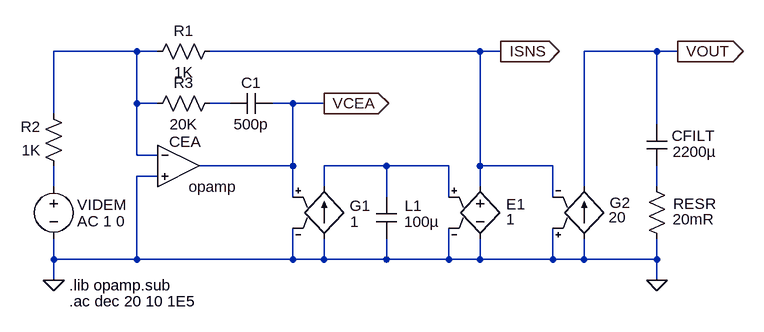
[diagram p0: schematic outfiltimodeb.asc]
outfiltimodeb.asc, the LTspice schematic file:
Version 4
SHEET 1 880 680
WIRE -944 224 -944 128
WIRE -944 336 -944 304
WIRE -944 448 -944 416
WIRE -944 480 -944 448
WIRE -816 128 -944 128
WIRE -816 208 -816 128
WIRE -816 288 -816 208
WIRE -816 448 -944 448
WIRE -816 448 -816 320
WIRE -784 128 -816 128
WIRE -784 208 -816 208
WIRE -784 288 -816 288
WIRE -784 320 -816 320
WIRE -672 208 -704 208
WIRE -576 208 -608 208
WIRE -576 304 -720 304
WIRE -576 304 -576 208
WIRE -576 352 -576 304
WIRE -576 448 -816 448
WIRE -576 448 -576 400
WIRE -528 208 -576 208
WIRE -528 336 -528 304
WIRE -528 448 -576 448
WIRE -528 448 -528 416
WIRE -432 304 -528 304
WIRE -432 352 -432 304
WIRE -432 448 -528 448
WIRE -432 448 -432 416
WIRE -336 304 -432 304
WIRE -336 352 -336 304
WIRE -336 448 -432 448
WIRE -336 448 -336 400
WIRE -288 128 -704 128
WIRE -288 304 -288 128
WIRE -288 336 -288 304
WIRE -288 448 -336 448
WIRE -288 448 -288 416
WIRE -256 128 -288 128
WIRE -176 304 -288 304
WIRE -176 352 -176 304
WIRE -176 448 -288 448
WIRE -176 448 -176 400
WIRE -128 336 -128 128
WIRE -128 448 -176 448
WIRE -128 448 -128 416
WIRE -16 128 -128 128
WIRE -16 240 -16 128
WIRE -16 336 -16 304
WIRE -16 448 -128 448
WIRE -16 448 -16 416
WIRE -16 480 -16 448
WIRE 16 128 -16 128
FLAG 16 128 VOUT
IOPIN 16 128 Out
FLAG -16 480 0
FLAG -944 480 0
FLAG -528 208 VCEA
IOPIN -528 208 Out
FLAG -256 128 ISNS
IOPIN -256 128 Out
SYMBOL cap -32 240 R0
WINDOW 0 39 18 Left 0
WINDOW 3 40 42 Left 0
SYMATTR InstName CFILT
SYMATTR Value 2200µ
SYMBOL res -32 320 R0
WINDOW 0 41 42 Left 0
WINDOW 3 40 66 Left 0
SYMATTR InstName RESR
SYMATTR Value 20mR
SYMBOL cap -448 352 R0
WINDOW 0 44 13 Left 0
WINDOW 3 43 38 Left 0
SYMATTR InstName L1
SYMATTR Value 100µ
SYMBOL g -528 320 R0
WINDOW 0 39 45 Left 0
WINDOW 3 40 70 Left 0
SYMATTR InstName G1
SYMATTR Value 1
SYMBOL Opamps\\opamp -752 240 R0
WINDOW 0 -14 27 Left 0
SYMATTR InstName CEA
SYMATTR SpiceLine2 GBW=2Meg
SYMBOL res -688 112 R90
WINDOW 0 0 56 VBottom 0
WINDOW 3 32 56 VTop 0
SYMATTR InstName R1
SYMATTR Value 1K
SYMBOL res -928 320 R180
WINDOW 0 36 76 Left 0
WINDOW 3 36 40 Left 0
SYMATTR InstName R2
SYMATTR Value 1K
SYMBOL res -800 224 R270
WINDOW 0 32 56 VTop 0
WINDOW 3 0 56 VBottom 0
SYMATTR InstName R3
SYMATTR Value 20K
SYMBOL voltage -944 320 R0
WINDOW 0 36 44 Left 0
WINDOW 3 37 68 Left 0
WINDOW 123 36 69 Left 0
WINDOW 39 0 0 Left 0
SYMATTR InstName VIDEM
SYMATTR Value ""
SYMATTR Value2 AC 1 0
SYMBOL e -288 320 R0
WINDOW 0 40 43 Left 0
WINDOW 3 40 66 Left 0
SYMATTR InstName E1
SYMATTR Value 1
SYMBOL cap -608 192 R90
WINDOW 0 0 32 VBottom 0
WINDOW 3 32 32 VTop 0
SYMATTR InstName C1
SYMATTR Value 500p
SYMBOL g2 -128 320 R0
WINDOW 0 39 41 Left 0
WINDOW 3 38 63 Left 0
SYMATTR InstName G2
SYMATTR Value 20
TEXT -920 488 Left 0 !.lib opamp.sub
TEXT -920 512 Left 0 !.ac dec 20 10 1E5

The netlist it stands for:
* outfiltimodeb.asc
CFILT VOUT N005 2200µ
RESR N005 0 20mR
C§L1 N004 0 100µ
G1 0 N004 VCEA 0 1
XCEA N001 0 VCEA opamp Aol=100K GBW=2Meg  ; pins invin noninvin out
R1 ISNS N001 1K
R2 N002 N001 1K
R3 N001 N003 20K
VIDEM N002 0 AC 1 0
E1 ISNS 0 N004 0 1
C1 VCEA N003 500p
G2 0 VOUT 0 ISNS 20
.lib opamp.sub
.ac dec 20 10 1E5
.backanno
.end